# Altium schematic sheet Sheet1.SchDoc
size A4; SheetNumber: 1; SheetTotal: 1
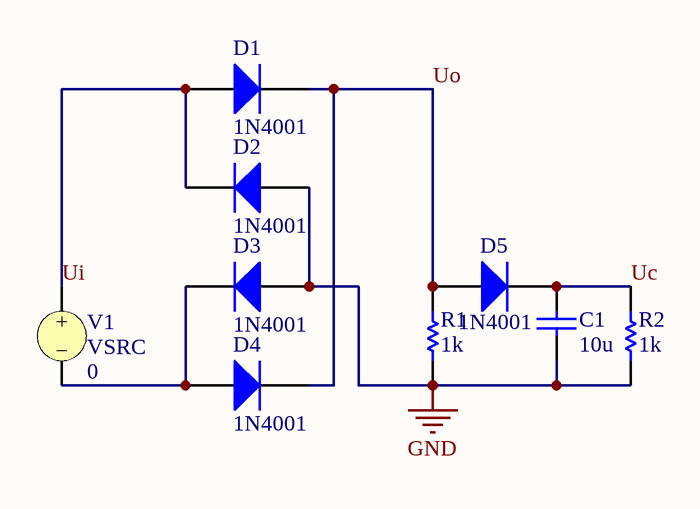
[diagram p0: Sheet1.SchDoc]

## Parts
C1  value 10u  (hidden comment: Capacitor)
D1  1N4001  [DO-41]
D2  1N4001  [DO-41]
D3  1N4001  [DO-41]
D4  1N4001  [DO-41]
D5  1N4001  [DO-41]
R1  value 1k  (hidden comment: Resistor)
R2  value 1k  (hidden comment: Resistor)
V1  VSRC  DC Magnitude: 0

## Nets
GND: C1.1 D2.1(A) D3.1(A) R1.2 R2.2
Uc: C1.2 D5.2(K) R2.1
Ui: D1.1(A) D2.2(K) V1.1
Uo: D1.2(K) D4.2(K) D5.1(A) R1.1
NetD3_2: D3.2(K) D4.1(A) V1.2

## Library data of the parts
C1 = Capacitor: SimulationGenericComponent: True
D1-D5 = Diode 1N4001: 1 Amp General Purpose Rectifier; Published: 8-Jun-2000; LatestRevisionDate: 17-Jul-2002; LatestRevisionNote: Re-released for DXP Platform.; DatasheetVersion: 1998; PackageVersion: Aug-1999; PackageReference: DO-41; Publisher: Altium Limited; PackageDescription: Diode, Axial; Body 5.2 x 2.7 mm (LxDia. max), Lead Dia. 0.86 mm (max); Code_JEDEC: DO-204-AL; ComponentLink1Description: Manufacturer Link; ComponentLink1URL: http://www.fairchildsemi.com/; ComponentLink2Description: Datasheet; ComponentLink2URL: http://www.fairchildsemi.com/ds/1N%2F1N4001.pdf
R1 R2 = Resistor: TC1: 0; SimulationGenericComponent: True; TC2: 0
V1 = VSRC: Voltage Source; Note: PCB Footprint - Not required; AC Magnitude: 1; Frequency: 1k; Published: 30-July-2020; LatestRevisionDate: 30-July-2020; LatestRevisionNote: Re-released for DXP Platform.; PackageReference: Not Applicable; Publisher: Altium Limited; AC Phase: 0; Offset: 0; Amplitude: 1; Delay: 0; Damping Factor: 0; Phase: 0